# Altium schematic sheet Mother.SchDoc
size A; SheetNumber: 1; SheetTotal: 2
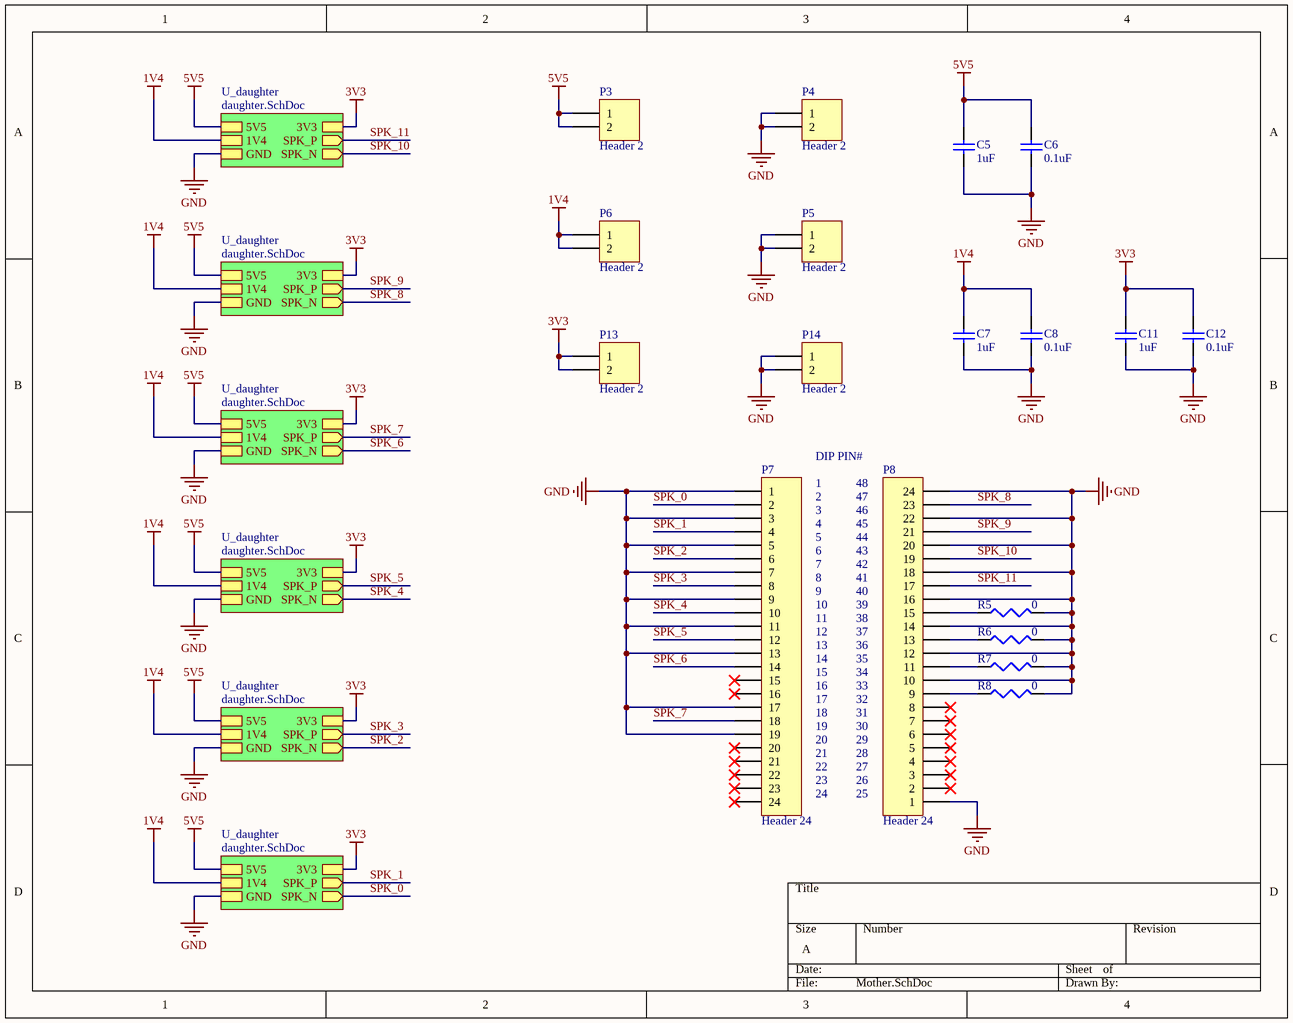
[diagram p0: Mother.SchDoc]

## Parts
C5  1uF  [SMD-0805]
C6  0.1uF  [SMD-0603]
C7  1uF  [SMD-0805]
C8  0.1uF  [SMD-0603]
C11  1uF  [SMD-0805]
C12  0.1uF  [SMD-0603]
P3  Header 2  [HDR1X2]
P4  Header 2  [HDR1X2]
P5  Header 2  [HDR1X2]
P6  Header 2  [HDR1X2]
P7  Header 24  [HDR1X24]
P8  Header 24  [HDR1X24]
P13  Header 2  [HDR1X2]
P14  Header 2  [HDR1X2]
R5  0  [SMD-0603]
R6  0  [SMD-0603]
R7  0  [SMD-0603]
R8  0  [SMD-0603]

## Sub-sheets
U_daughter = daughter.SchDoc: 1V4, 5V5, SPK_P (out), SPK_N (out), GND, 3V3
U_daughter = daughter.SchDoc: 1V4, 5V5, SPK_P (out), SPK_N (out), GND, 3V3
U_daughter = daughter.SchDoc: 1V4, 5V5, SPK_P (out), SPK_N (out), GND, 3V3
U_daughter = daughter.SchDoc: 1V4, 5V5, SPK_P (out), SPK_N (out), GND, 3V3
U_daughter = daughter.SchDoc: 1V4, 5V5, SPK_P (out), SPK_N (out), GND, 3V3
U_daughter = daughter.SchDoc: 1V4, 5V5, SPK_P (out), SPK_N (out), GND, 3V3

## Nets
1V4: C7.2 C8.2 P6.1 P6.2 ; sheet U_daughter/1V4, sheet U_daughter/1V4, sheet U_daughter/1V4, sheet U_daughter/1V4, sheet U_daughter/1V4, sheet U_daughter/1V4
3V3: C11.2 C12.2 P13.1 P13.2 ; sheet U_daughter/3V3, sheet U_daughter/3V3, sheet U_daughter/3V3, sheet U_daughter/3V3, sheet U_daughter/3V3, sheet U_daughter/3V3
5V5: C5.2 C6.2 P3.1 P3.2 ; sheet U_daughter/5V5, sheet U_daughter/5V5, sheet U_daughter/5V5, sheet U_daughter/5V5, sheet U_daughter/5V5, sheet U_daughter/5V5
GND: C5.1 C6.1 C7.1 C8.1 C11.1 C12.1 P4.1 P4.2 P5.1 P5.2 P7.1 P7.3 P7.5 P7.7 P7.9 P7.11 P7.13 P7.17 P7.19 P8.1 P8.10 P8.12 P8.14 P8.16 P8.18 P8.20 P8.22 P8.24 P14.1 P14.2 R5.2 R6.2 R7.2 R8.2 ; sheet U_daughter/GND, sheet U_daughter/GND, sheet U_daughter/GND, sheet U_daughter/GND, sheet U_daughter/GND, sheet U_daughter/GND
SPK_0: P7.2 ; sheet U_daughter/SPK_N
SPK_1: P7.4 ; sheet U_daughter/SPK_P
SPK_2: P7.6 ; sheet U_daughter/SPK_N
SPK_3: P7.8 ; sheet U_daughter/SPK_P
SPK_4: P7.10 ; sheet U_daughter/SPK_N
SPK_5: P7.12 ; sheet U_daughter/SPK_P
SPK_6: P7.14 ; sheet U_daughter/SPK_N
SPK_7: P7.18 ; sheet U_daughter/SPK_P
SPK_8: P8.23 ; sheet U_daughter/SPK_N
SPK_9: P8.21 ; sheet U_daughter/SPK_P
SPK_10: P8.19 ; sheet U_daughter/SPK_N
SPK_11: P8.17 ; sheet U_daughter/SPK_P
NetP8_9: P8.9 R8.1
NetP8_11: P8.11 R7.1
NetP8_13: P8.13 R6.1
NetP8_15: P8.15 R5.1

Not connected (* = marked no-connect by the designer): P7 15* 16* 20* 21* 22* 23* 24*; P8 2* 3* 4* 5* 6* 7* 8*

## Notes on the sheet
- DIP PIN#
- 1
- 2
- 48
- 47
- 3
- 4
- 5
- 6
- 7
- 46
- 45
- 44
- 43
- 42
- 8
- 9
- 10
- 11
- 12
- 41
- 40
- 39
- 38
- 37
- 13
- 14
- 15
- 16
- 17
- 36
- 35
- 34
- 33
- 32
- 18
- 19
- 20
- 21
- 22
- 31
- 30
- 29
- 28
- 27
- 23
- 24
- 26
- 25

## Library data of the parts
C5 C7 C11 = CAP0805: Ceramic Capacitor 0805 Imperial (2012 Metric)
C6 C8 C12 = CAP0603: Ceramic Capacitor 0603
P3-P6 P13 P14 = Header 2: Header, 2-Pin; LatestRevisionDate: 17-Jul-2002; LatestRevisionNote: Re-released for DXP Platform.; Publisher: Altium Limited
P7 P8 = Header 24: Header, 24-Pin; LatestRevisionDate: 17-Jul-2002; LatestRevisionNote: Re-released for DXP Platform.; Publisher: Altium Limited
R5-R8 = RES0603: Resistor-0603